# EAGLE design battery_buzzer (EAGLE 6.5.0)
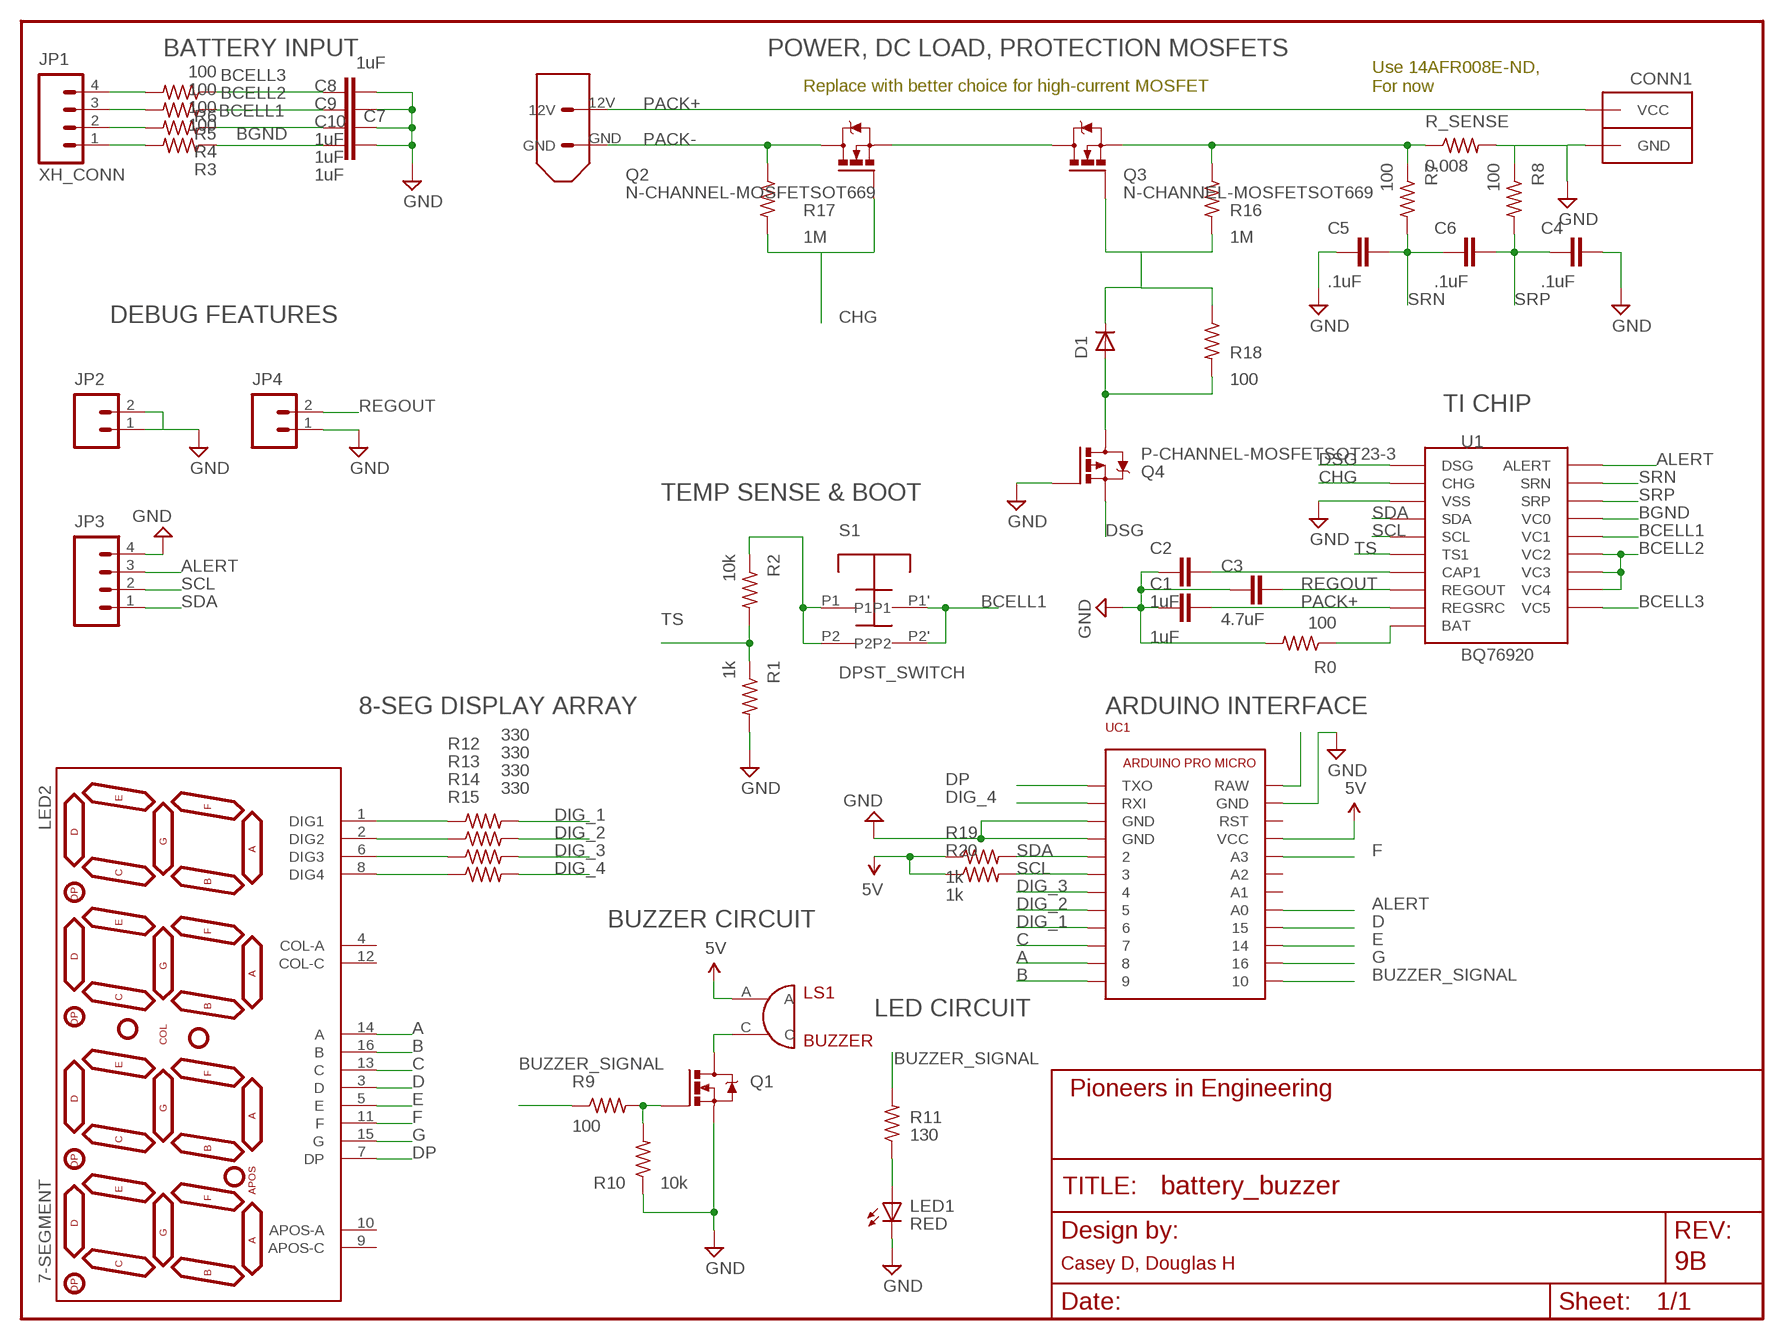
[diagram p0: schematic, sheet 1]
FRAME1 (FRAME-LETTER): AUTHOR: Casey D, Douglas H; REVISION: 9B

## Parts
C1  1uF  CAP0603-CAP  [0603-CAP]
C2  1uF  CAP0603-CAP  [0603-CAP]
C3  4.7uF  CAP0603-CAP  [0603-CAP]
C4  .1uF  CAP0603-CAP  [0603-CAP]
C5  .1uF  CAP0603-CAP  [0603-CAP]
C6  .1uF  CAP0603-CAP  [0603-CAP]
C7  1uF  CAP0603-CAP  [0603-CAP]
C8  1uF  CAP0603-CAP  [0603-CAP]
C9  1uF  CAP0603-CAP  [0603-CAP]
C10  1uF  CAP0603-CAP  [0603-CAP]
CONN1  ANDERSONVERTICAL  [ANDERSON_VERTICAL]
D1  DIODESOD-323  [SOD-323]
JP1  XH_CONN  XH_CONNECTOR_4POS  [XH_CONNECTOR_4POS_2.5MM]
JP2  M02PTH  [1X02]
JP3  M04PTH  [1X04]
JP4  M02PTH  [1X02]
LED1  RED  LED0805  [LED-0805]
LED2  7-SEGMENT  7-SEGMENT-4DIGIT-YOUNGSUN  [7-SEGMENT-4DIGIT-YOUNGSUN]
LS1  BUZZER  [BUZZER_MAGNETIC_5V_12MM_RADIAL]
Q1  IRFML8244  N-CHANNEL-MOSFETSOT23-3  [SOT23-3]
Q2  N-CHANNEL-MOSFETSOT669  [SOT669]
Q3  N-CHANNEL-MOSFETSOT669  [SOT669]
Q4  P-CHANNEL-MOSFETSOT23-3  [SOT23-3]
R0  100  R-US_R0603  [R0603]
R1  1k  R-US_R0603  [R0603]
R2  10k  R-US_R0603  [R0603]
R3  100  R-US_R0603  [R0603]
R4  100  R-US_R0603  [R0603]
R5  100  R-US_R0603  [R0603]
R6  100  R-US_R0603  [R0603]
R7  100  R-US_R0603  [R0603]
R8  100  R-US_R0603  [R0603]
R9  100  R-US_R0603  [R0603]
R10  10k  R-US_R0603  [R0603]
R11  130  R-US_R0603  [R0603]
R12  330  R-US_R0603  [R0603]
R13  330  R-US_R0603  [R0603]
R14  330  R-US_R0603  [R0603]
R15  330  R-US_R0603  [R0603]
R16  1M  R-US_R0603  [R0603]
R17  1M  R-US_R0603  [R0603]
R18  100  R-US_R0603  [R0603]
R19  1k  R-US_R0603  [R0603]
R20  1k  R-US_R0603  [R0603]
R_SENSE  0.008  R-US_V235/17  [V235/17]
S1  DPST_SWITCH  [C&K_SWITCH]
U1  BQ76920  [20-TSSOP]
U$1  XT60CONNECTOR  [XT60CONNECTOR]
UC1  ARDUINO_PRO_MICRO  [ARDUINO_PRO_MICRO]

## Nets
5V: LS1.A R19.1 R20.1 UC1.VCC
A: LED2.14(A) UC1.8
ALERT: JP3.3 U1.P$20(ALERT) UC1.A0
B: LED2.16(B) UC1.9
BCELL1: C9.1 R4.1 S1.P1' S1.P2' U1.P$16(VC1)
BCELL2: C8.1 R5.1 U1.P$13(VC4) U1.P$14(VC3) U1.P$15(VC2)
BCELL3: C7.2 R6.1 U1.P$12(VC5)
BGND: C10.1 R3.1 U1.P$17(VC0)
BUZZER_SIGNAL: R9.1 R11.2 UC1.10
C: LED2.13(C) UC1.7
CHG: Q2.4(G) R17.2 U1.P$2(CHG)
D: LED2.3(D) UC1.15
DIG_1: R12.2 UC1.6
DIG_2: R13.2 UC1.5
DIG_3: R14.2 UC1.4
DIG_4: R15.2 UC1.RXI
DP: LED2.7(DP) UC1.TXO
DSG: Q4.2(S) U1.P$1(DSG)
E: LED2.5(E) UC1.14
F: LED2.11(F) UC1.A3
G: LED2.15(G) UC1.16
GND: C1.1 C2.1 C3.1 C4.2 C5.1 C7.1 C8.2 C9.2 C10.2 CONN1.PIN1(GND) JP2.1 JP2.2 JP3.4 JP4.1 LED1.C Q1.2(S) Q4.1(G) R0.2 R1.2 R8.1 R10.1 R_SENSE.2 U1.P$3(VSS) UC1.GND@0(GND) UC1.GND@1(GND) UC1.GND@2(GND)
N$1: R0.1 U1.P$10(BAT)
N$2: C2.2 U1.P$7(CAP1)
N$3: JP1.1 R3.2
N$4: JP1.2 R4.2
N$5: LS1.C Q1.3(D)
N$6: Q1.1(G) R9.2 R10.2
N$7: LED1.A R11.1
N$8: R2.1 S1.P1 S1.P2
N$9: LED2.1(DIG1) R12.1
N$10: JP1.3 R5.2
N$11: LED2.2(DIG2) R13.1
N$12: JP1.4 R6.2
N$13: LED2.6(DIG3) R14.1
N$14: Q2.1(S) Q2.2(S) Q2.3(S) Q3.MB(D)
N$15: LED2.8(DIG4) R15.1
N$16: Q3.1(S) Q3.2(S) Q3.3(S) R7.1 R16.1 R_SENSE.1
N$17: D1.1(A) Q4.3(D) R18.2
N$18: D1.2(C) Q3.4(G) R16.2 R18.1
PACK+: C1.2 CONN1.PIN2(VCC) U1.P$9(REGSRC) U$1.12V
PACK-: Q2.MB(D) R17.1 U$1.GND
RAW: UC1.RAW
REGOUT: C3.2 JP4.2 U1.P$8(REGOUT)
SCL: JP3.2 R20.2 U1.P$5(SCL) UC1.3
SDA: JP3.1 R19.2 U1.P$4(SDA) UC1.2
SRN: C5.2 C6.1 R7.2 U1.P$19(SRN)
SRP: C4.1 C6.2 R8.2 U1.P$18(SRP)
TS: R1.1 R2.2 U1.P$6(TS1)
Unconnected: LED2.4(COL-A) LED2.9(APOS-C) LED2.10(APOS-A) LED2.12(COL-C) UC1.A1 UC1.A2 UC1.RST

## Notes on the sheet
- BATTERY INPUT | POWER, DC LOAD, PROTECTION MOSFETS
- Replace with better choice for high-current MOSFET
- Use 14AFR008E-ND,
  For now
- DEBUG FEATURES
- TI CHIP
- TEMP SENSE & BOOT
- 8-SEG DISPLAY ARRAY | ARDUINO INTERFACE
- BUZZER CIRCUIT
- LED CIRCUIT

## Library data of the parts
C1-C10 = pie:CAP: Capacitor Standard 0603 ceramic capacitor, and 0.1" leaded capacitor.; PIE-INT-REF-NUM: CAPACITOR-GENERIC
CONN1 = pie:ANDERSON: 2-pin 25A Anderson Connector http://www.alliedelec.com/images/products/datasheets/bm/ANDERSON_POWER_PRODUCTS/70162018.pdf; PIE-INT-REF-NUM: Anderson
D1 = pie:DIODE: Diode These are standard reverse protection diodes and small signal diodes. SMA package can handle up to about 1A. SOD-323 can handle about 200mA. What the SOD-323 package when ordering, there are some mfgs out there that are 5-pin packages.; PIE-INT-REF-NUM: DIODE
JP1 = pie:XH_CONNECTOR_4POS: 4-pin XH connector (through-hole type shrouded header); PIE-INT-REF-NUM: XH-4POS; PIE_DIGIKEY-PN: 455-2249-ND
JP2 JP4 = pie:M02: 2-pin 0.1-inch header and MTA connector; PIE-INT-REF-NUM: BULK-STOCK
JP3 = pie:M04: 4-pin 0.1-inch header and MTA connector; PIE-INT-REF-NUM: BULK-STOCK
LED1 = pie:LED: LEDs Standard schematic elements and footprints for 5mm, 3mm, 1206, and 0603 sized LEDs. 5mm - Spark Fun Electronics SKU : COM-00529 (and others); PIE-INT-REF-NUM: LED
LED2 = pie:7-SEGMENT-4DIGIT-YOUNGSUN: This is a part for the 4-Digit 7-segment LEDs from Young Sun. Different from the Digikey LEDs, all 16 pins are used. The LONGPADS Variant is used for a test jig, but you may like it because there is more pad to solder to. If you are concerned about routing space, the standard works just fine though.
LS1 = pie:BUZZER: Buzzer; PIE-INT-REF-NUM: BUZZER; PIE_DIGIKEY-PN: 102-1269-ND
Q1 = pie:N-CHANNEL-MOSFET: N-channel TrenchMOS (TM) logic level FET Source: SOT23-3: http://www.nxp.com/documents/data_sheet/BSS123.pdf SOT669: http://www.nxp.com/documents/data_sheet/PH7030L.pdf
Q2 Q3 = pie:N-CHANNEL-MOSFET: N-channel TrenchMOS (TM) logic level FET Source: SOT23-3: http://www.nxp.com/documents/data_sheet/BSS123.pdf SOT669: http://www.nxp.com/documents/data_sheet/PH7030L.pdf; PIE-DIGIKEY-PN-PRI: 568-6738-1-ND; PIE-INT-REF-NUM: NMOS
Q4 = pie:P-CHANNEL-MOSFET: P-Channel PowerTrench® MOSFET Source: FDD4141.pdf; PIE-DIGIKEY-PN-PRI: IRLML6402PBFCT-ND; PIE-INT-REF-NUM: PMOS
R0 R1-R20 R_SENSE = pie:R-US_: RESISTOR, American symbol; PIE-INT-REF-NUM: RESISTOR-GENERIC
S1 = pie:DPST_SWITCH: Double Throw, single pole normally open pushbutton switch. 401-1133-ND
U1 = pie:BQ76920: BQ76920, a TSSOP Battery monotoring chip by TI
U$1 = pie:XT60CONNECTOR: 12V XT60 power connector; PARTNUMBER: PRT-10474
UC1 = pie:ARDUINO_PRO_MICRO: Arduino Pro Micro Electrical System Year 9's Smart Sensor Core Pin Outs <https://cdn.sparkfun.com/assets/9/c/3/c/4/523a1765757b7f5c6e8b4567.png> Buy Here <http://www.aliexpress.com/item/Mini-Leonardo-Pro-Micro-ATmega32U4-5V-16MHz-Module-For-Arduino-Best-Quality/32284746884.html?ws_ab_test=searchweb201556_8,searchweb201602_2_10057_10056_10065_10055_10054_10067_10069_10059_10058_10017_10070_10060_10061_10052_10062_10053_10050_10051,searchweb201603_1&btsid=45993952-29ca-4de4-a0fb-c7fb72b8e1a5>

## Board
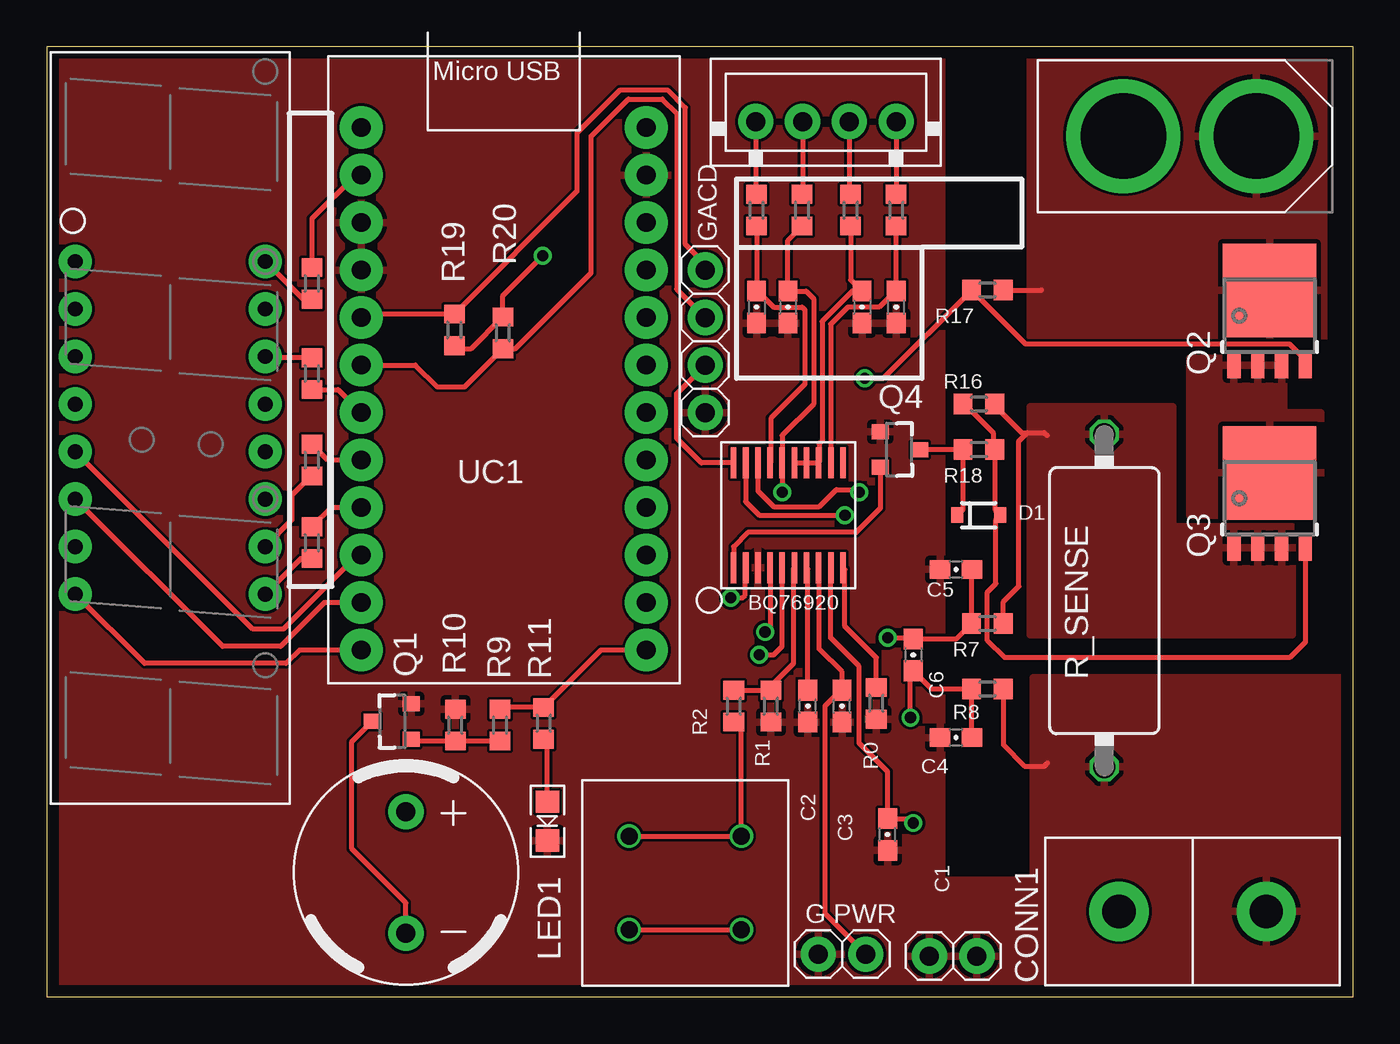
[diagram p1: board, top side]
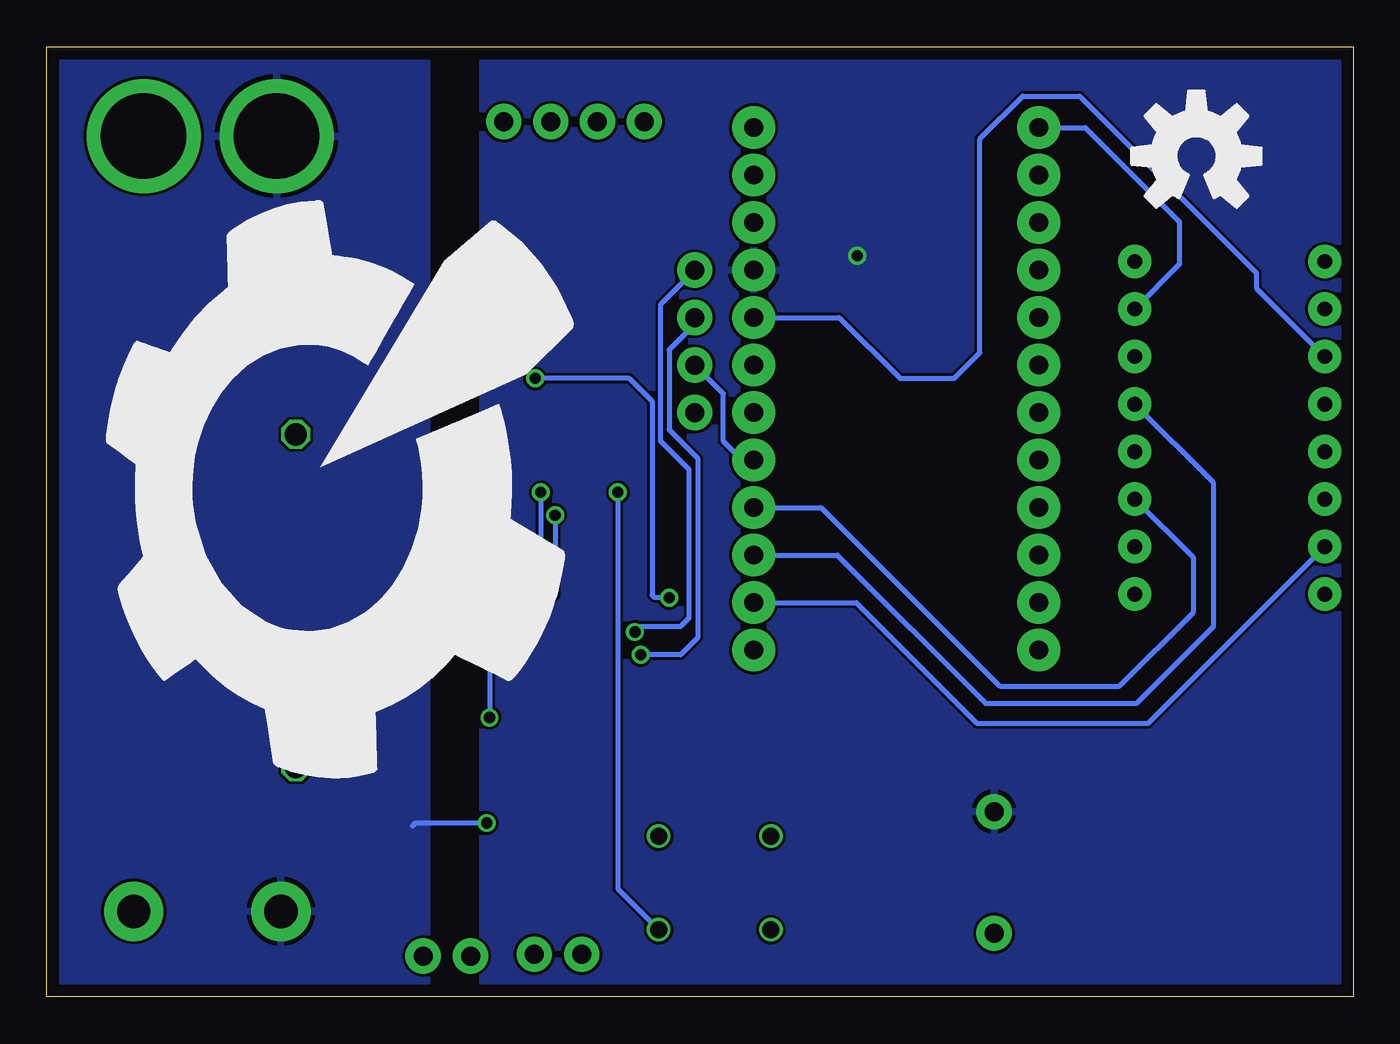
[diagram p2: board, bottom side, seen from below]

Size 69.85 x 50.8 mm. Coordinates in mm from the lower left corner, seen from the top.
Outline: 0,0 69.85,0 69.85,50.8 0,50.8 0,0
Copper layers (1*16): Top 2mil / dielectric 9mil / Bottom 2mil
Design rules "pie": minimum track width 6mil, minimum drill 15mil, track to track 6mil, track to pad 6mil, pad to pad 6mil, via to via 6mil, smd to smd 6mil, copper to edge 25mil, drill to drill 7mil, minimum pad ring 7mil, minimum via ring 7mil, stop-mask expansion 3mil, vias tented up to drill 21mil, thermal gap 10mil

### Footprints (pad centres in the part's own frame; a part is rotated, then mirrored left to right if it is on the bottom)
0603-CAP = smd 1.1 x 1: 1 -0.85,0; 2 0.85,0
ANDERSON_VERTICAL = drill 1.778 pad 3.175: PIN1 0,-3.937; PIN2 0,3.937
SOD-323 = smd 0.63 x 0.83: 1 -1.15,0; 2 1.15,0
XH_CONNECTOR_4POS_2.5MM = drill 1.016 pad 1.88: 1 -3.95,-0.19; 2 -1.45,-0.19; 3 1.05,-0.19; 4 3.55,-0.19
1X02 = drill 1.016 pad 1.88: 1 -1.27,0; 2 1.27,0
1X04 = drill 1.016 pad 1.88: 1 -3.81,0; 2 -1.27,0; 3 1.27,0; 4 3.81,0
LED-0805 = smd 1.194 x 1.245: A -1.041,0; C 1.041,0
7-SEGMENT-4DIGIT-YOUNGSUN = drill 0.8 pad 1.778: 1 -8.89,-5.08; 2 -6.35,-5.08; 3 -3.81,-5.08; 4 -1.27,-5.08; 5 1.27,-5.08; 6 3.81,-5.08; 7 6.35,-5.08; 8 8.89,-5.08; 9 8.89,5.08; 10 6.35,5.08; 11 3.81,5.08; 12 1.27,5.08; 13 -1.27,5.08; 14 -3.81,5.08; 15 -6.35,5.08; 16 -8.89,5.08
BUZZER_MAGNETIC_5V_12MM_RADIAL = drill 1.016 pad 1.88: A 0,3.25; C 0,-3.25
SOT23-3 = smd 0.8 x 0.9: 1 -0.95,-1; 2 0.95,-1; 3 0,1.1
SOT669 = smd 0.7 x 1.4: 1 -1.905,-2.65; 2 -0.635,-2.65; 3 0.635,-2.65; 4 1.905,-2.65 | smd 5 x 5: MB 0,1.35
R0603 = smd 1 x 1.1: 1 -0.85,0; 2 0.85,0
V235/17 = drill 1.194 octagon: 1 -8.89,0; 2 8.89,0
C&K_SWITCH = drill 0.9: P1 -3,2.5; P1' -3,-2.5; P2 3,2.5; P2' 3,-2.5
20-TSSOP = smd 0.3 x 1.66: P$1 -2.6,-2.8; P$2 -1.95,-2.8; P$3 -1.3,-2.8; P$4 -0.65,-2.8; P$5 0,-2.8; P$6 0.65,-2.8; P$7 1.3,-2.8; P$8 1.95,-2.8; P$9 2.6,-2.8; P$10 3.25,-2.8; P$11 3.25,2.8; P$12 2.6,2.8; P$13 1.95,2.8; P$14 1.3,2.8; P$15 0.65,2.8; P$16 0,2.8; P$17 -0.65,2.8; P$18 -1.3,2.8; P$19 -1.95,2.8; P$20 -2.6,2.8
XT60CONNECTOR = drill 4.572 pad 6.096: 12V -3.556,0; GND 3.556,0
ARDUINO_PRO_MICRO = drill 1 pad 2.286: 2 1.778,19.558; 3 1.778,17.018; 4 1.778,14.478; 5 1.778,11.938; 6 1.778,9.398; 7 1.778,6.858; 8 1.778,4.318; 9 1.778,1.778; 10 17.018,1.778; 14 17.018,6.858; 15 17.018,9.398; 16 17.018,4.318; A0 17.018,11.938; A1 17.018,14.478; A2 17.018,17.018; A3 17.018,19.558; GND@0 1.778,24.638; GND@1 1.778,22.098; GND@2 17.018,27.178; RAW 17.018,29.718; RST 17.018,24.638; RXI 1.778,27.178; TXO 1.778,29.718; VCC 17.018,22.098

### Placement (x,y rotation side)
C1  44.96,8.69 90 top
C2  40.69,15.54 90 top
C3  42.52,15.54 90 top
C4  48.62,13.87 180 top
C5  48.62,22.86 0 top
C6  46.33,18.29 270 top
C7  45.42,36.88 90 top
C8  43.59,36.88 270 top
C9  39.62,36.88 270 top
C10  37.95,36.88 270 top
CONN1  61.26,4.57 90 top
D1  49.83,25.76 0 top
JP1  41.86,46.99 0 top
JP2  48.46,2.18 0 top
JP3  35.2,35.05 270 top
JP4  42.52,2.29 0 top
LED1  26.77,9.4 270 top
LED2  6.6,30.43 90 top
LS1  19.2,6.65 0 top
Q1  18.49,14.73 90 top
Q2  65.38,36.42 0 top
Q3  65.38,26.67 0 top
Q4  45.57,29.26 270 top
R0  44.35,15.7 270 top
R1  38.71,15.54 270 top
R2  36.73,15.54 90 top
R3  37.95,42.06 90 top
R4  40.39,42.06 90 top
R5  42.98,42.06 90 top
R6  45.42,42.06 90 top
R7  50.29,19.96 180 top
R8  50.29,16.46 180 top
R9  24.23,14.53 270 top
R10  21.84,14.53 270 top
R11  26.57,14.63 90 top
R12  14.17,24.28 90 top
R13  14.17,28.7 90 top
R14  14.17,33.32 270 top
R15  14.17,38.15 90 top
R16  49.83,31.7 180 top
R17  50.29,37.8 180 top
R18  49.83,29.26 180 top
R19  21.79,35.66 90 top
R20  24.38,35.51 270 top
R_SENSE  56.54,21.18 270 top
S1  34.14,6.1 0 top
U1  39.32,25.76 0 top
U$1  61.11,46.02 0 top
U$2  [OSHW-LOGO-L]  8.38,44.96 0 bottom
U$4  [PIE-LOGO]  55.02,28.19 90 bottom
UC1  15.04,16.76 0 top

### Tracks (layer width: path | path; a pad name or v marks a point on that pad's centre or on a via)
5V  (via drill 0.6)
  Top 0.254: v26.52,39.62 24.38,37.49 R20.1 22.68,34.66 21.92,34.66 21.92,34.68 R19.1
  pour Bottom: 0.76,0.76 46.53,0.76 46.53,50.04 0.76,50.04
A
  Top 0.254: UC1.8 14.83,21.08 12.5,18.75 9.4,18.75 LED2.14
ALERT
  Top 0.254: U1.P$20 34.99,28.56 33.68,29.87 33.68,32.26 JP3.3
  Bottom 0.254: UC1.A0 32.66,28.7 33.68,29.72 33.68,32.26 JP3.3
B
  Top 0.254: UC1.9 13.51,18.54 12.8,17.83 5.23,17.83 LED2.16
BCELL1  (via drill 0.6 pad 0.61)
  Top 0.254: R4.1 39.62,40.45 C9.1 40.6,37.73 41,37.34 41,31.7 39.32,30.02 U1.P$16 v39.32,26.98 | S1.P1' S1.P2'
  Bottom 0.254: v39.32,26.98 39.32,5.78 S1.P2'
BCELL2
  Top 0.254: U1.P$15 U1.P$14 U1.P$13 41.3,28.59 41.3,29.57 41.45,29.72 41.45,36.12 43.06,37.73 C8.1 42.98,38.34 R5.1
BCELL3
  Top 0.254: R6.1 C7.2 45.35,37.73 44.5,36.88 42.82,36.88 41.91,35.97 U1.P$12
BGND
  Top 0.254: R3.1 C10.1 38.01,37.73 38.86,36.88 40.39,36.88 40.54,36.73 40.54,32.77 38.71,30.94 38.71,28.6 U1.P$17
BUZZER_SIGNAL
  Top 0.254: UC1.10 29.63,18.54 R11.2 24.33,15.48 R9.1
C
  Top 0.254: UC1.7 16.61,23.62 12.65,19.66 11.02,19.66 LED2.13
CHG  (via drill 0.6 pad 0.61)
  Top 0.254: Q2.4 67.28,34.06 66.45,34.9 52.34,34.9 R17.2 44.72,33.07 v43.74,33.07 | v36.58,21.34 37.19,21.34 37.34,21.49 37.34,22.92 U1.P$2
  Bottom 0.254: v36.58,21.34 36.61,21.37 37.37,21.37 37.49,21.49 37.49,31.85 38.71,33.07 v43.74,33.07
D
  Bottom 0.254: UC1.15 28.45,26.16 18.9,16.61 12.5,16.61 8.53,20.57 8.53,23.47 LED2.3
DIG_1
  Top 0.254: UC1.6 15.2,26.16 R12.2
DIG_2
  Top 0.254: UC1.5 15.02,28.7 R13.2
DIG_3
  Top 0.254: R14.2 15.58,32.48 UC1.4
DIG_4
  Top 0.254: UC1.RXI 16.51,43.94 14.17,41.6 R15.2
DP
  Bottom 0.254: UC1.TXO 14.33,46.48 9.3,41.45 9.3,39.17 LED2.7
DSG
  Top 0.254: Q4.2 44.57,26.13 43.28,24.84 37.49,24.84 36.73,24.08 U1.P$1
E
  Bottom 0.254: UC1.14 27.58,23.62 19.66,15.7 11.58,15.7 7.47,19.81 7.47,27.48 LED2.5
F
  Bottom 0.254: UC1.A3 27.48,36.32 24.23,33.07 21.34,33.07 19.96,34.44 19.96,45.87 17.68,48.16 14.63,48.16 5.18,38.71 5.18,37.9 LED2.11
G
  Bottom 0.254: UC1.16 26.57,21.08 20.12,14.63 10.97,14.63 LED2.15
GND
  Top 0.254: R8.1 51.14,13.48 52.27,12.34 53.34,12.34 53.49,12.5
  pour Top: 69.19,0.46 0.46,0.46 0.46,50.44 47.85,50.44 47.85,6.25 52.73,6.25 52.73,17.07 69.19,17.07
N$1
  Top 0.254: R0.1 44.35,18.14 42.67,19.81 42.67,22.85 U1.P$10
N$2
  Top 0.254: C2.2 40.69,22.88 U1.P$7
N$3
  Top 0.254: JP1.1 37.91,42.95 R3.2
N$4
  Top 0.254: JP1.2 40.41,42.94 R4.2
N$5
  Top 0.254: LS1.C 19.2,5.03 16.31,7.92 16.31,13.65 Q1.3
N$6
  Top 0.254: R9.2 R10.2 19.59,13.68 Q1.1
N$7
  Top 0.254: LED1.A 26.77,13.58 R11.1
N$8
  Top 0.254: S1.P1 S1.P2 37.14,14.29 R2.1
N$9
  Top 0.254: R12.1 13.58,23.43 LED2.1
N$10
  Top 0.254: JP1.3 42.91,42.98 R5.2
N$11
  Top 0.254: R13.1 14.14,27.85 13.11,26.82 13.11,25.5 LED2.2
N$12
  Top 0.254: JP1.4 45.41,42.92 R6.2
N$13
  Top 0.254: R14.1 11.75,34.17 LED2.6
N$14
  pour Top: 68.12,25.76 61.11,25.76 61.11,34.14 66.14,34.14 66.14,31.24 68.12,31.24
N$15
  Top 0.254: R15.1 13.7,37.3 LED2.8
N$16
  Top 0.254: R16.1 50.69,31.61 52.12,30.18 52.43,30.18 | 52.43,30.18 53.34,30.18 53.49,30.02 | R7.1 51.14,21.12 51.97,21.95 51.97,29.72 52.43,30.18
  pour Top: 66.6,25.15 60.2,25.15 60.2,31.55 52.58,31.55 52.58,19.35 66.6,19.35
N$17
  Top 0.254: D1.1 48.98,26.06 R18.2 Q4.3
N$18
  Top 0.254: Q3.4 67.28,18.97 66.45,18.14 51.21,18.14 50.29,19.05 50.29,21.64 50.75,22.1 50.75,25.52 D1.2 50.69,26.06 R18.1 50.6,29.35 50.6,30.18 49.07,31.7 R16.2
PACK+  (via drill 0.6 pad 0.61)
  Top 0.254: U1.P$9 41.91,22.95 41.91,19.2 43.43,17.68 43.43,13.56 44.96,12.04 C1.2 46.09,9.54 v46.33,9.3
  Bottom 0.254: v46.33,9.3 50.14,9.3 50.29,9.14
  pour Bottom: 49.53,0.76 69.09,0.76 69.09,50.04 49.53,50.04
PACK-
  Top 0.254: R17.1 53.19,37.8
  pour Top: 68.28,35.2 52.58,35.2 52.58,50.14 68.28,50.14 68.28,35.36
REGOUT
  Top 0.254: U1.P$8 41.3,22.92 41.3,18.59 42.52,17.37 C3.2 42.45,16.39 41.6,15.54 41.6,4.47 JP4.2
SCL  (via drill 0.6 pad 0.61)
  Top 0.254: UC1.3 19.71,33.78 20.88,32.61 22.34,32.61 R20.2 25.06,34.66 29.11,38.71 29.11,46.02 31.09,48.01 32.92,48.01 33.68,47.24 33.68,37.85 JP3.2 | U1.P$5 39.32,18.75 38.86,18.29 v38.1,18.29
  Bottom 0.254: JP3.2 35.2,35.97 36.58,34.59 36.58,30.33 35.05,28.8 35.05,19.2 35.97,18.29 v38.1,18.29
SDA  (via drill 0.6 pad 0.61)
  Top 0.254: 16.85,36.36 UC1.2 17,36.51 R19.2 28.35,43.06 28.35,46.18 30.63,48.46 33.22,48.46 34.14,47.55 34.14,40.23 35.2,39.17 JP3.1 | 38.56,19.66 v38.41,19.51 38.67,19.77 U1.P$4
  Bottom 0.254: JP3.1 37.03,37.03 37.03,29.72 35.51,28.19 35.51,20.27 35.97,19.81 38.1,19.81 v38.41,19.51
SRN  (via drill 0.6 pad 0.61)
  Top 0.254: C5.2 49.44,22.84 R7.2 48.62,19.14 C6.1 46.27,19.2 v44.96,19.2 | U1.P$19 37.37,26.49 38.1,25.76 v42.67,25.76
  Bottom 0.254: v42.67,25.76 42.67,21.49 v44.96,19.2
SRP  (via drill 0.6 pad 0.61)
  Top 0.254: C4.1 49.47,16.44 R8.2 47.31,16.46 C6.2 46.18,17.29 v46.18,14.94 | U1.P$18 38.02,27.06 38.86,26.21 41.3,26.21 42.22,27.13 43.28,27.13 v43.43,26.98
  Bottom 0.254: v43.43,26.98 43.43,22.1 46.18,19.36 v46.18,14.94
TS
  Top 0.254: R2.2 R1.1 38.71,16.61 39.93,17.83 39.93,22.91 U1.P$6

### Text on the board
tPlace: GACD | G PWR
tValues: R3 thru R6 / All 100 | R12 thru R16 / All 330 | + - | POWER IN | C7 thru C10 / All 1uF | BOOT? | TO LOAD | + - | GND | PiE Robotics / Battery Buzzer / Year 9 Rev. B / EXPERIMENTAL
bValues: (c) Pioneers in Engineering. / Design by: D. Hutchings. / This design is open source hardware. / For more information, visit / pioneers.berkeley.edu/opensource. | PiE Robotics / Battery Buzzer / Year 9 Rev. B / EXPERIMENTAL